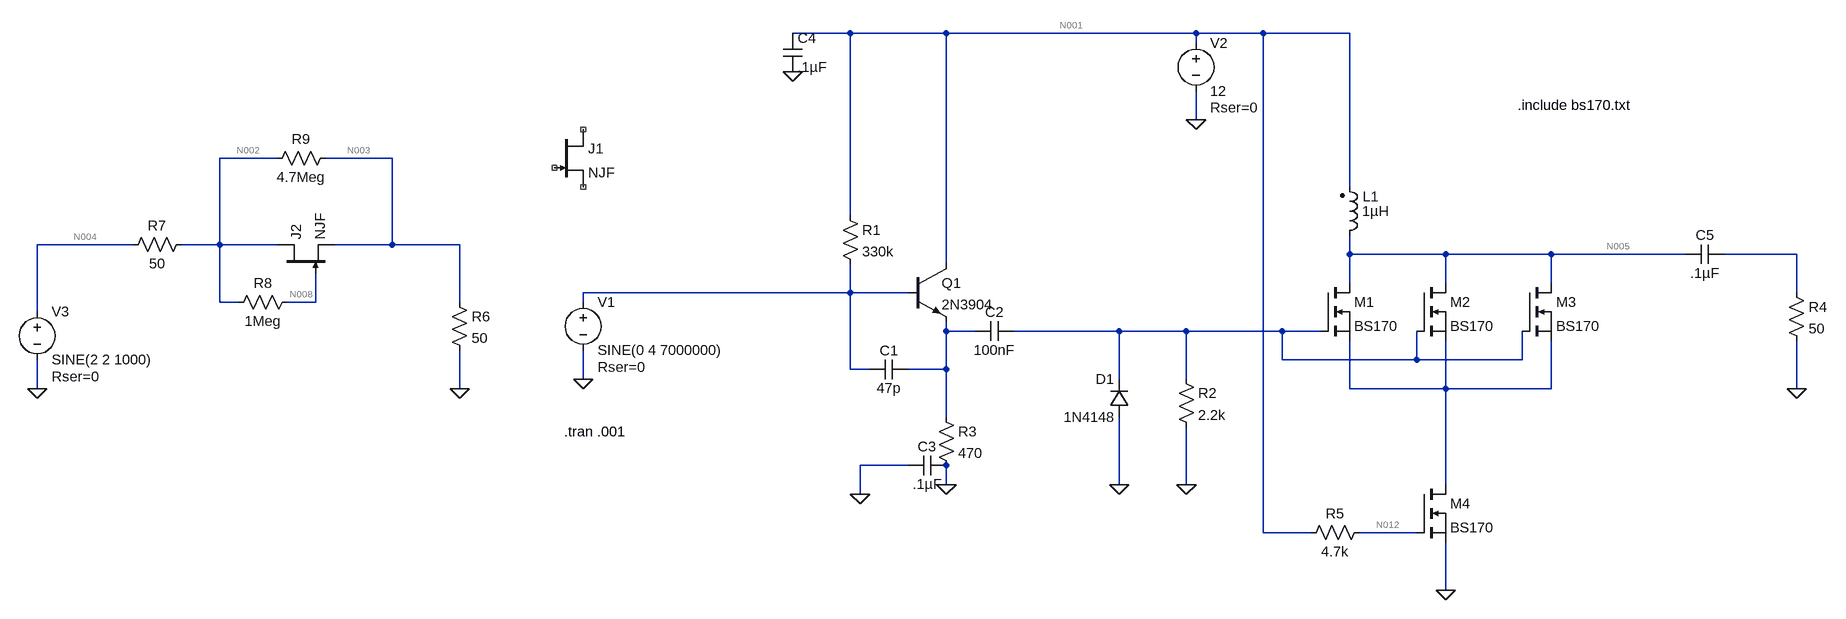
[diagram p0: schematic paraset40 (1).asc]
paraset40 (1).asc, the LTspice schematic file:
Version 4
SHEET 1 1812 868
WIRE 112 -80 16 -80
WIRE 272 -80 112 -80
WIRE 688 -80 272 -80
WIRE 800 -80 688 -80
WIRE 944 -80 800 -80
WIRE 688 -64 688 -80
WIRE 688 64 688 16
WIRE -1360 128 -1456 128
WIRE -1168 128 -1280 128
WIRE 944 176 944 -80
WIRE 112 224 112 -80
WIRE -1600 272 -1760 272
WIRE -1456 272 -1456 128
WIRE -1456 272 -1520 272
WIRE -1360 272 -1456 272
WIRE -1168 272 -1168 128
WIRE -1168 272 -1264 272
WIRE -1056 272 -1168 272
WIRE 944 288 944 256
WIRE 1104 288 944 288
WIRE 1280 288 1104 288
WIRE 1504 288 1280 288
WIRE 1744 288 1568 288
WIRE 272 304 272 -80
WIRE 944 336 944 288
WIRE 1104 336 1104 288
WIRE 1280 336 1280 288
WIRE 112 352 112 304
WIRE 112 352 -400 352
WIRE 208 352 112 352
WIRE 1744 352 1744 288
WIRE -1456 368 -1456 272
WIRE -1424 368 -1456 368
WIRE -1296 368 -1296 320
WIRE -1296 368 -1344 368
WIRE -1056 368 -1056 272
WIRE -400 368 -400 352
WIRE -1760 384 -1760 272
WIRE 272 416 272 400
WIRE 320 416 272 416
WIRE 560 416 384 416
WIRE 672 416 560 416
WIRE 832 416 672 416
WIRE 896 416 832 416
WIRE 832 464 832 416
WIRE 1056 464 1056 416
WIRE 1056 464 832 464
WIRE 1232 464 1232 416
WIRE 1232 464 1056 464
WIRE 112 480 112 352
WIRE 144 480 112 480
WIRE 272 480 272 416
WIRE 272 480 208 480
WIRE -400 496 -400 448
WIRE 560 496 560 416
WIRE 672 496 672 416
WIRE -1760 512 -1760 464
WIRE -1056 512 -1056 448
WIRE 944 512 944 432
WIRE 1104 512 1104 432
WIRE 1104 512 944 512
WIRE 1280 512 1280 432
WIRE 1280 512 1104 512
WIRE 1744 512 1744 432
WIRE 272 560 272 480
WIRE 208 640 128 640
WIRE 272 672 272 640
WIRE 560 672 560 560
WIRE 672 672 672 576
WIRE 1104 672 1104 512
WIRE 128 688 128 640
WIRE 800 752 800 -80
WIRE 880 752 800 752
WIRE 1056 752 960 752
WIRE 1104 848 1104 768
FLAG -400 496 0
FLAG 272 672 0
FLAG 16 -16 0
FLAG 688 64 0
FLAG 560 672 0
FLAG 672 672 0
FLAG 1744 512 0
FLAG 128 688 0
FLAG 1104 848 0
FLAG -1760 512 0
FLAG -1056 512 0
SYMBOL voltage -400 352 R0
WINDOW 123 0 0 Left 0
WINDOW 39 24 124 Left 2
SYMATTR SpiceLine Rser=0
SYMATTR InstName V1
SYMATTR Value SINE(0 4 7000000)
SYMBOL res 96 208 R0
SYMATTR InstName R1
SYMATTR Value 330k
SYMBOL res 256 544 R0
SYMATTR InstName R3
SYMATTR Value 470
SYMBOL cap 384 400 R90
WINDOW 0 0 32 VBottom 2
WINDOW 3 32 32 VTop 2
SYMATTR InstName C2
SYMATTR Value 100nF
SYMBOL npn 208 304 R0
SYMATTR InstName Q1
SYMATTR Value 2N3904
SYMBOL cap 0 -80 R0
SYMATTR InstName C4
SYMATTR Value .1µF
SYMBOL voltage 688 -80 R0
WINDOW 123 0 0 Left 0
WINDOW 39 24 124 Left 2
SYMATTR SpiceLine Rser=0
SYMATTR InstName V2
SYMATTR Value 12
SYMBOL cap 208 464 R90
WINDOW 0 0 32 VBottom 2
WINDOW 3 32 32 VTop 2
SYMATTR InstName C1
SYMATTR Value 47p
SYMBOL res 656 480 R0
SYMATTR InstName R2
SYMATTR Value 2.2k
SYMBOL diode 576 560 R180
WINDOW 0 24 64 Left 2
WINDOW 3 24 0 Left 2
SYMATTR InstName D1
SYMATTR Value 1N4148
SYMBOL ind2 928 272 M180
WINDOW 0 38 80 Left 2
WINDOW 3 37 56 Left 2
SYMATTR InstName L1
SYMATTR Value 1µH
SYMATTR Type ind
SYMBOL nmos 896 336 R0
SYMATTR InstName M1
SYMATTR Value BS170
SYMATTR Prefix X
SYMBOL res 1728 336 R0
SYMATTR InstName R4
SYMATTR Value 50
SYMBOL cap 1568 272 R90
WINDOW 0 0 32 VBottom 2
WINDOW 3 32 32 VTop 2
SYMATTR InstName C5
SYMATTR Value .1µF
SYMBOL nmos 1056 336 R0
SYMATTR InstName M2
SYMATTR Value BS170
SYMATTR Prefix X
SYMBOL nmos 1232 336 R0
SYMATTR InstName M3
SYMATTR Value BS170
SYMATTR Prefix X
SYMBOL cap 272 624 R90
WINDOW 0 0 32 VBottom 2
WINDOW 3 32 32 VTop 2
SYMATTR InstName C3
SYMATTR Value .1µF
SYMBOL nmos 1056 672 R0
SYMATTR InstName M4
SYMATTR Value BS170
SYMATTR Prefix X
SYMBOL res 976 736 R90
WINDOW 0 0 56 VBottom 2
WINDOW 3 32 56 VTop 2
SYMATTR InstName R5
SYMATTR Value 4.7k
SYMBOL njf -448 80 R0
SYMATTR InstName J1
SYMBOL voltage -1760 368 R0
WINDOW 123 0 0 Left 0
WINDOW 39 24 124 Left 2
SYMATTR SpiceLine Rser=0
SYMATTR InstName V3
SYMATTR Value SINE(2 2 1000)
SYMBOL njf -1360 320 R270
SYMATTR InstName J2
SYMBOL res -1072 352 R0
SYMATTR InstName R6
SYMATTR Value 50
SYMBOL res -1504 256 R90
WINDOW 0 0 56 VBottom 2
WINDOW 3 32 56 VTop 2
SYMATTR InstName R7
SYMATTR Value 50
SYMBOL res -1328 352 R90
WINDOW 0 0 56 VBottom 2
WINDOW 3 32 56 VTop 2
SYMATTR InstName R8
SYMATTR Value 1Meg
SYMBOL res -1264 112 R90
WINDOW 0 0 56 VBottom 2
WINDOW 3 32 56 VTop 2
SYMATTR InstName R9
SYMATTR Value 4.7Meg
TEXT -432 584 Left 2 !.tran .001
TEXT 1224 40 Left 2 !.include bs170.txt

The netlist it stands for:
* paraset40 (1).asc
V1 N007 0 SINE(0 4 7000000) Rser=0
R1 N001 N007 330k
R3 N009 0 470
C2 N010 N009 100nF
Q1 N001 N007 N009 0 2N3904
C4 N001 0 .1µF
V2 N001 0 12 Rser=0
C1 N009 N007 47p
R2 N010 0 2.2k
D1 0 N010 1N4148
L1 N005 N001 1µH
XM1 N005 N010 N011 BS170  ; pins D G S
R4 N006 0 50
C5 N006 N005 .1µF
XM2 N005 N010 N011 BS170  ; pins D G S
XM3 N005 N010 N011 BS170  ; pins D G S
C3 0 0 .1µF
XM4 N011 N012 0 BS170  ; pins D G S
R5 N012 N001 4.7k
J1 NC_01 NC_02 NC_03 NJF
V3 N004 0 SINE(2 2 1000) Rser=0
J2 N002 N008 N003 NJF
R6 N003 0 50
R7 N002 N004 50
R8 N008 N002 1Meg
R9 N003 N002 4.7Meg
.model D D
.lib standard.dio
.model NPN NPN
.model PNP PNP
.lib standard.bjt
.model NJF NJF
.model PJF PJF
.lib standard.jft
.tran .001
.include bs170.txt
.backanno
.end

* Results of the author's LTspice run, read from the files saved beside the schematic
* Operating Point, zero values left out:
*   V(n001) = 12 V
*   V(n005) = 12 V
*   V(n012) = 12 V
*   V(n004) = 2 V
*   V(n002) = 1.97 V
*   V(n008) = 515.7 mV
*   V(n003) = 29.51 mV
*   Ic(Q1) = 12.03 pA
*   Ib(Q1) = -12 pA
*   I(L1) = -161.6 pA
*   Id(J2) = 588.4 µA
*   Ig(J2) = 1.455 µA
*   Is(J2) = -589.8 µA
*   I(R9) = -413 nA
*   I(R8) = -1.455 µA
*   I(R7) = -590.2 µA
*   I(R6) = 590.2 µA
*   I(R1) = 36.36 µA
*   I(V3) = -590.2 µA
*   I(V2) = -36.36 µA
*   I(V1) = 36.36 µA
*   Ix(m1:1) = 54.25 pA
*   Ix(m1:3) = -54.15 pA
*   Ix(m2:1) = 54.25 pA
*   Ix(m2:3) = -54.15 pA
*   Ix(m3:1) = 54.25 pA
*   Ix(m3:3) = -54.15 pA
*   Ix(m4:1) = 162.4 pA
*   Ix(m4:3) = -162.4 pA